# Altium project Modulo de apertura.PrjPcb
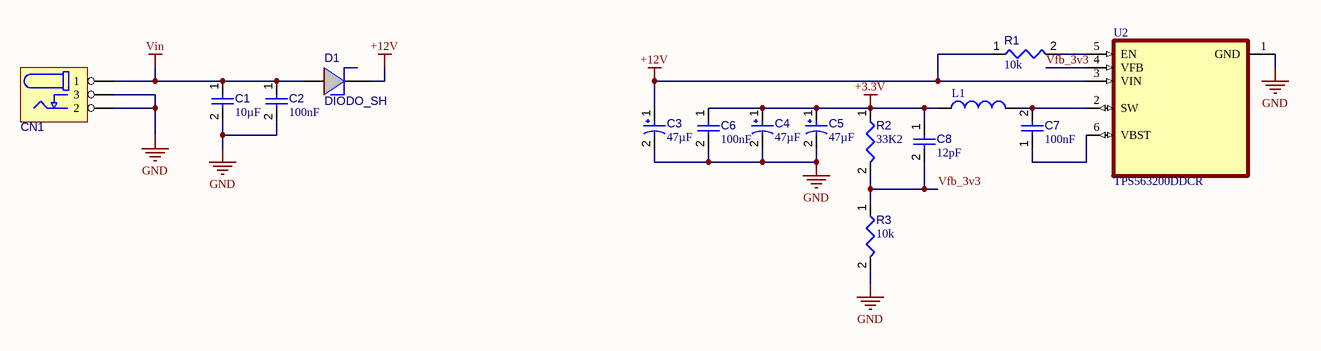
[diagram p0: Modulo_de_apertura_Power.SchDoc]
4 sheets, 75 parts. Net scope: global (net labels, ports and power ports of the same name join across sheets).
Board file: Modulo_de_apertura_PCB.PcbDoc
Sheets:
  Modulo_de_apertura_Power.SchDoc
  Modulo_de_apertura_RS485.SchDoc
  Modulo_de_apertura_perifericos.SchDoc
  Modulo_de_apertura_CPU.SchDoc

## Sheet Modulo_de_apertura_Power.SchDoc: Modulo de apertura Power
size A4; Author: Agustin Dubuisson; SheetNumber: 1; SheetTotal: 4

### Parts
C1  value 10µF  [CAPC0603(1608)100_L]  (hidden comment: Capacitor 10µF +/-20% 10V 0603)
C2  value 100nF  [CAPC0402(1005)60_L]  (hidden comment: Capacitor 100nF +/-20% 10V 0402)
C3  value 47µF  [CAPMP3217X18-T_V]  (hidden comment: TAJA105K035RNJ)
C4  value 47µF  [CAPMP3217X18-T_V]  (hidden comment: TAJA105K035RNJ)
C5  value 47µF  [CAPMP3217X18-T_V]  (hidden comment: TAJA105K035RNJ)
C6  value 100nF  [CAPC0402(1005)60_L]  (hidden comment: Capacitor 100nF +/-20% 50V 0402)
C7  value 100nF  [CAPC0402(1005)60_L]  (hidden comment: Capacitor 100nF +/-20% 10V 0402)
C8  value 12pF  [CAPC0402(1005)33_L]  (hidden comment: Capacitor 12pF +/-10% 50V 0402)
CN1  CN_PowerJack  [PJ002B]  (value not drawn)
D1  DIODO_SH  [D_SMA]
L1  IFSC1515AHER2R2M01  [FP-IFSC1515AH-MFG]  (value not drawn)
R1  value 10k  [RESC0402(1005)_L]  (hidden comment: Resistor 10K  +/-1 % 0402 63 mW)
R2  value 33K2  [RESC0402(1005)_L]  (hidden comment: Resistor 10K  +/-1 % 0402 63 mW)
R3  value 10k  [RESC0402(1005)_L]  (hidden comment: Resistor 10K  +/-1 % 0402 63 mW)
U2  TPS563200DDCR  [SOT23-6]

### Nets
+3.3V: C4.1 C5.1 C6.1 C8.1 L1.1 R2.1
+12V: C3.1 D1.2(K) R1.1 U2.3(VIN)
GND: C1.2 C2.2 C3.2 C4.2 C5.2 C6.2 CN1.2 CN1.3 R3.2 U2.1(GND)
Vin: C1.1 C2.1 CN1.1 D1.1(A)
Vfb_3v3: C8.2 R2.2 R3.1 U2.4(VFB)
NetC7_1: C7.1 U2.6(VBST)
NetC7_2: C7.2 L1.2 U2.2(SW)
NetR1_2: R1.2 U2.5(EN)

### Notes on the sheet
- Title:
- Size:
- Author:
- A4
- Sheet
- of
- Revision:
- File:
- Date:

### Library data of the parts
C1 = CMP-001-00075-4: Chip Capacitor, 10µF +/-20%, 10V, 0603, Thickness 1 mm; Tolerance: 10%; Voltage Rating: 10V; Max Operating Temperature: 85°C; Pins: 2; Case/Package: 0603; Mounting Technology: SMT; Min Operating Temperature: -55°C
C2 C7 = CMP-001-00061-3: Chip Capacitor, 100nF +/-20%, 10V, 0402, Thickness 0.6 mm; Tolerance: 20%; Mounting Technology: SMT; Voltage Rating: 10V; Max Operating Temperature: 85°C; Pins: 2; Case/Package: 0402; Min Operating Temperature: -55°C
C3-C5 = CMP-001-00040-7: Standard Tantalum, 1 uF, +/- 10%, 35 V, -55 to 125 degC, 1206 (3216 Metric), RoHS, Tape and Reel; Manufacturer: AVX; Voltage Rating: 35V; ESR: 7.5Ohm; Package Quantity: 2000; Case/Package: 1206; Datasheet Version: Feb-16; Tolerance: 10%; Max Operating Temperature: 125°C; Mounting Technology: SM; Package URL: http://www.avx.com/download/software/literature/AVX-Footprint-Library.pdf; Package Reference: CAPMP3217X18-T; Manufacturer URL: http://www.avx.com/; Min Operating Temperature: -55°C; Pins: 2; RoHS Compliant: True; Packaging: TapeandReel; Resistance: 7.5Ohm; Package Description: 2-Pin Surface Mount Device, Body 3.2 x 1.65 mm; Datasheet URL: http://datasheets.avx.com/TAJ.pdf; Capacitor Type: Tantalum
C6 = CMP-001-00067-3: Chip Capacitor, 100nF +/-20%, 50V, 0402, Thickness 0.6 mm; Tolerance: 10%; Min Operating Temperature: -55°C; Pins: 2; Case/Package: 0402; Max Operating Temperature: 85°C; Voltage Rating: 50V; Mounting Technology: SMT
C8 = CMP-001-00072-4: Chip Capacitor, 12pF +/-10%, 50V, 0402, Thickness 0.33 mm; Tolerance: 20%; Pins: 2; Max Operating Temperature: 85°C; Case/Package: 0402; Voltage Rating: 50V; Mounting Technology: SMT; Min Operating Temperature: -55°C
CN1 = CN_PowerJack: Barrel Power Connector
D1 = DIODO_SH: Diode Shottky
L1 = CMP-006-00026-1: General Purpose Inductor, 2.2uH, 20%, 1 Element, SMD, 1515; Max Current Rating: 3A; Max Operating Temperature: 125°C; Tolerance: 20%; RoHS Compliant: Yes; Pins: 2; Min Operating Temperature: -55°C
R1 R3 = CMP-009-00149-3: Chip Resistor, 10 kOhms, +/-1 %, 63 mW, -55 to 125 degC, 0402; Power: 63mW; Tolerance: 1%; Min Operating Temperature: -55°C; Case/Package: 0402; Max Operating Temperature: 155°C; Pins: 2
R2 = CMP-009-00149-3: Power: 63mW; Tolerance: 1%; Min Operating Temperature: -55°C; Case/Package: 0402; Max Operating Temperature: 155°C; Pins: 2
U2 = TPS563200DDCR: 17 V Input, 3A Synchronous Step-Down Regulator in SOT-23 with Advanced Eco-modeâ„¢; MF: Texas Instruments; SnapEDA_Link: https://www.snapeda.com/parts/TPS563200DDCR/Texas+Instruments/view-part/?ref=snap; Package: SOT-23-THN-6 Texas Instruments; Value: *; MP: TPS563200DDCR; Check_prices: https://www.snapeda.com/parts/TPS563200DDCR/Texas+Instruments/view-part/?ref=eda

## Sheet Modulo_de_apertura_RS485.SchDoc: Modulo de apertura RS485
size A4; Author: Agustin Dubuisson; SheetNumber: 2; SheetTotal: 4
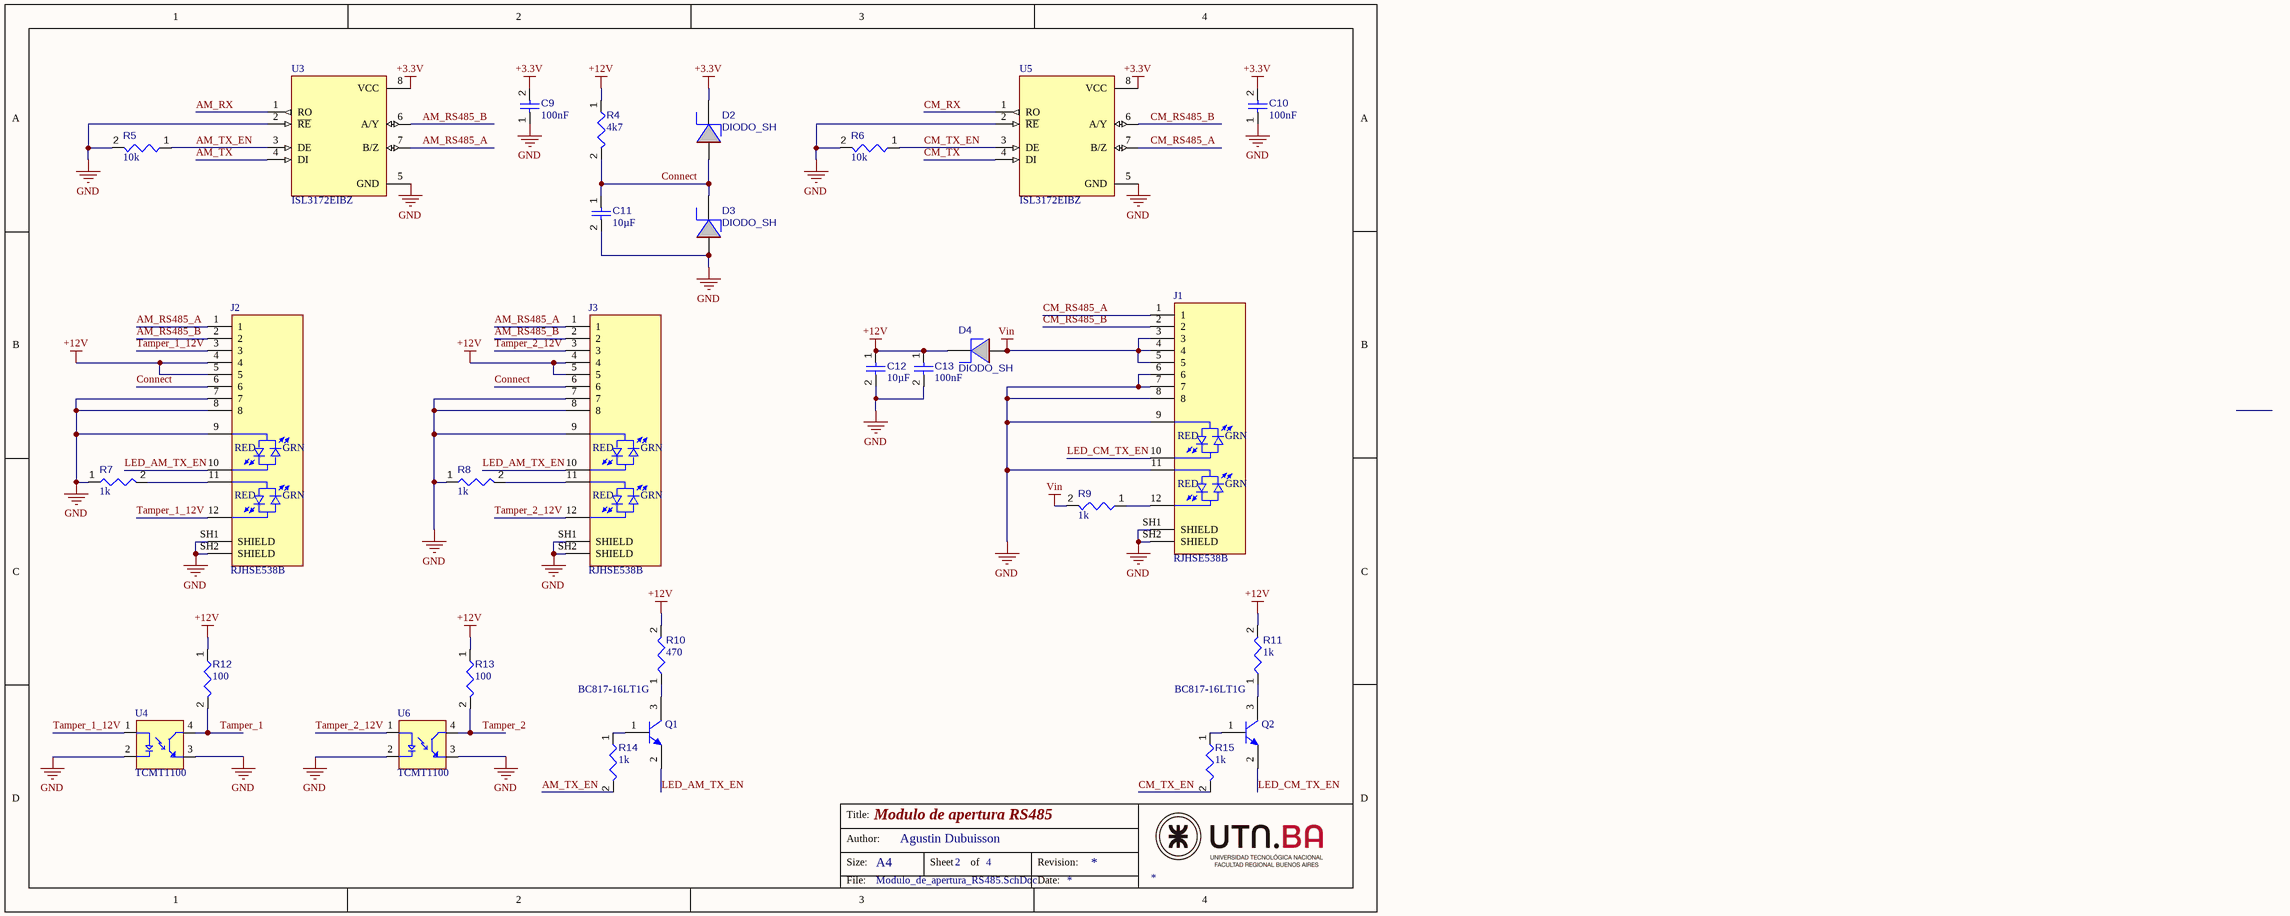
[diagram p1: Modulo_de_apertura_RS485.SchDoc]

### Parts
C9  value 100nF  [CAPC0402(1005)60_L]  (hidden comment: Capacitor 100nF +/-20% 10V 0402)
C10  value 100nF  [CAPC0402(1005)60_L]  (hidden comment: Capacitor 100nF +/-20% 10V 0402)
C11  value 10µF  [CAPC0603(1608)100_L]  (hidden comment: Capacitor 10µF +/-20% 10V 0603)
C12  value 10µF  [CAPC0603(1608)100_L]  (hidden comment: Capacitor 10µF +/-20% 10V 0603)
C13  value 100nF  [CAPC0402(1005)60_L]  (hidden comment: Capacitor 100nF +/-20% 10V 0402)
D2  DIODO_SH  [D_SMA]
D3  DIODO_SH  [D_SMA]
D4  DIODO_SH  [D_SMA]
J1  RJHSE538B  [AMPHENOL_RJHSE538B]
J2  RJHSE538B  [AMPHENOL_RJHSE538B]
J3  RJHSE538B  [AMPHENOL_RJHSE538B]
Q1  BC817-16LT1G  [ONSC-SOT-23-3-318-08_V]
Q2  BC817-16LT1G  [ONSC-SOT-23-3-318-08_V]
R4  value 4k7  [RESC0402(1005)_L]  (hidden comment: Resistor 10K  +/-1 % 0402 63 mW)
R5  value 10k  [RESC0402(1005)_L]  (hidden comment: Resistor 10K  +/-1 % 0402 63 mW)
R6  value 10k  [RESC0402(1005)_L]  (hidden comment: Resistor 10K  +/-1 % 0402 63 mW)
R7  value 1k  [RESC0402(1005)_L]  (hidden comment: Resistor 10K  +/-1 % 0402 63 mW)
R8  value 1k  [RESC0402(1005)_L]  (hidden comment: Resistor 10K  +/-1 % 0402 63 mW)
R9  value 1k  [RESC0402(1005)_L]  (hidden comment: Resistor 10K  +/-1 % 0402 63 mW)
R10  value 470  [RESC0402(1005)_L]  (hidden comment: Resistor 10K  +/-1 % 0402 63 mW)
R11  value 1k  [RESC0402(1005)_L]  (hidden comment: Resistor 10K  +/-1 % 0402 63 mW)
R12  value 100  [RESC0402(1005)_L]  (hidden comment: Resistor 10K  +/-1 % 0402 63 mW)
R13  value 100  [RESC0402(1005)_L]  (hidden comment: Resistor 10K  +/-1 % 0402 63 mW)
R14  value 1k  [RESC0402(1005)_L]  (hidden comment: Resistor 10K  +/-1 % 0402 63 mW)
R15  value 1k  [RESC0402(1005)_L]  (hidden comment: Resistor 10K  +/-1 % 0402 63 mW)
U3  ISL3172EIBZ  [SOIC127P600X175-8N]
U4  TCMT1100  [SOIC127P700X230-4N]
U5  ISL3172EIBZ  [SOIC127P600X175-8N]
U6  TCMT1100  [SOIC127P700X230-4N]

### Nets
+3.3V: C9.2 C10.2 D2.2(K) U3.8(VCC) U5.8(VCC)
+12V: C12.1 C13.1 D4.2(K) J2.4 J2.5 J3.4 J3.5 R4.1 R10.2 R11.2 R12.1 R13.1
GND: C9.1 C10.1 C11.2 C12.2 C13.2 D3.1(A) J1.6 J1.7 J1.8 J1.9 J1.11 J1.SH1(SHIELD) J1.SH2(SHIELD) J2.7 J2.8 J2.9 J2.SH1(SHIELD) J2.SH2(SHIELD) J3.7 J3.8 J3.9 J3.SH1(SHIELD) J3.SH2(SHIELD) R5.2 R6.2 R7.1 R8.1 U3.2(~{RE}) U3.5(GND) U4.2(C) U4.3(ET) U5.2(~{RE}) U5.5(GND) U6.2(C) U6.3(ET)
Vin: D4.1(A) J1.3 J1.4 J1.5 R9.2
AM_RS485_A: J2.1 J3.1 U3.7(B/Z)
AM_RS485_B: J2.2 J3.2 U3.6(A/Y)
AM_RX: U3.1(RO)
AM_TX: U3.4(DI)
AM_TX_EN: R5.1 R14.2 U3.3(DE)
CM_RS485_A: J1.1 U5.7(B/Z)
CM_RS485_B: J1.2 U5.6(A/Y)
CM_RX: U5.1(RO)
CM_TX: U5.4(DI)
CM_TX_EN: R6.1 R15.2 U5.3(DE)
Connect: C11.1 D2.1(A) D3.2(K) J2.6 J3.6 R4.2
LED_AM_TX_EN: J2.10 J3.10 Q1.2(E)
LED_CM_TX_EN: J1.10 Q2.2(E)
Tamper_1: R12.2 U4.4(CT)
Tamper_1_12V: J2.3 J2.12 U4.1(A)
Tamper_2: R13.2 U6.4(CT)
Tamper_2_12V: J3.3 J3.12 U6.1(A)
NetJ1_12: J1.12 R9.1
NetJ2_11: J2.11 R7.2
NetJ3_11: J3.11 R8.2
NetQ1_1: Q1.1(B) R14.1
NetQ1_3: Q1.3(C) R10.1
NetQ2_1: Q2.1(B) R15.1
NetQ2_3: Q2.3(C) R11.1

### Notes on the sheet
- Title:
- Size:
- Author:
- A4
- Sheet
- of
- Revision:
- File:
- Date:
- (in symbol RJHSE538B) RED; GRN

### Library data of the parts
C9 C10 C13 = CMP-001-00061-3: as C2 on sheet Modulo_de_apertura_Power; Mounting Technology: SMT; Voltage Rating: 10V; Max Operating Temperature: 85°C; Pins: 2; Case/Package: 0402; Min Operating Temperature: -55°C
C11 C12 = CMP-001-00075-4: as C1 on sheet Modulo_de_apertura_Power; Voltage Rating: 10V; Max Operating Temperature: 85°C; Pins: 2; Case/Package: 0603; Mounting Technology: SMT; Min Operating Temperature: -55°C
D2-D4 = DIODO_SH: Diode Shottky
J1-J3 = RJHSE538B: MF: {'manufacturer': u'Amphenol ICC (Commercial Products)'}; Package: None; Price: None; Value: *; MP: RJHSE538B; Availability: Unavailable
Q1 Q2 = CMP-1048-00736-1: General Purpose Transistor, NPN Silicon, 3-Pin SOT-23, Pb-Free, Tape and Reel; Manufacturer: On Semiconductor; IC Continuous (A): 0.5; fT Min (MHz): 100; PartNumber: BC817-16LT1G; Mounting Technology: Surface Mount; PackageVersion: Rev. AP, 11/2009; ComponentLink3Description: Package Specification; PackageReference: SOT-23-3-318-08; Packing: Tape and Reel; ComponentLink1URL: http://www.onsemi.com/; Polarity: NPN; RoHS: TRUE; ComponentLink2URL: http://www.onsemi.com/pub_link/Collateral/BC817-16LT1-D.PDF; ComponentLink3URL: http://www.onsemi.cn/pub_link/Collateral/318-08.PDF; ComponentLink2Description: Datasheet; PackageDescription: 3-Pin Small Outline Transistor, Body 2.92 x 1.3 mm, Pitch 0.95 mm; ComponentLink1Description: Manufacturer URL; DatasheetVersion: Rev. 12
R4-R15 = CMP-009-00149-3: as R1 on sheet Modulo_de_apertura_Power; Min Operating Temperature: -55°C; Case/Package: 0402; Max Operating Temperature: 155°C; Pins: 2
U3 U5 = ISL3172EIBZ: 1/1 Transceiver Half RS422, RS485 8-SOIC; MF: Renesas Electronics America Inc; SnapEDA_Link: https://www.snapeda.com/parts/ISL3172EIBZ/Renesas/view-part/?ref=snap; Package: SOIC-8 Renesas; Value: *; MP: ISL3172EIBZ; Check_prices: https://www.snapeda.com/parts/ISL3172EIBZ/Renesas/view-part/?ref=eda
U4 U6 = TCMT1100: Optoisolator Transistor Output 3750Vrms 1 Channel 4-SOP; MF: Vishay Semiconductor; SnapEDA_Link: https://www.snapeda.com/parts/TCMT1100/Vishay/view-part/?ref=snap; Package: SOP-4 Vishay Semiconductor; Value: *; MP: TCMT1100; Check_prices: https://www.snapeda.com/parts/TCMT1100/Vishay/view-part/?ref=eda

## Sheet Modulo_de_apertura_perifericos.SchDoc
size A4; SheetNumber: 3; SheetTotal: 4
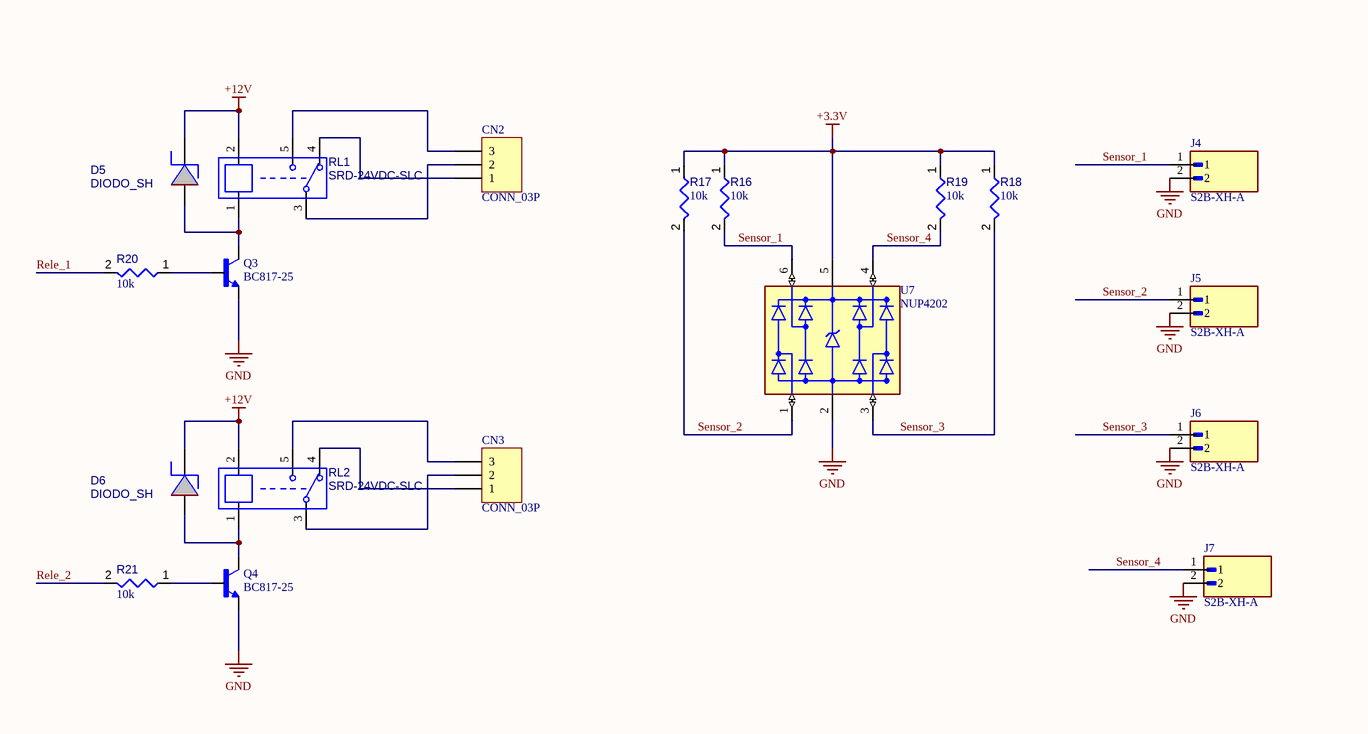
[diagram p2: Modulo_de_apertura_perifericos.SchDoc, left]
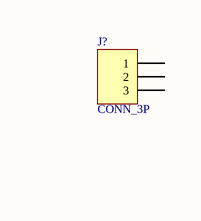
[diagram p3: Modulo_de_apertura_perifericos.SchDoc, right]

### Parts
CN2  CONN_03P  [TerminalBlock_1x3_P5mm]
CN3  CONN_03P  [TerminalBlock_1x3_P5mm]
D5  DIODO_SH  [D_SMA]
D6  DIODO_SH  [D_SMA]
J4  S2B-XH-A  [JST_S2B-XH-A]
J5  S2B-XH-A  [JST_S2B-XH-A]
J6  S2B-XH-A  [JST_S2B-XH-A]
J7  S2B-XH-A  [JST_S2B-XH-A]
J?  CONN_3P  [BORNERA_3P_P_5mm]
Q3  BC817-25  [SOT95P240X120-3N]
Q4  BC817-25  [SOT95P240X120-3N]
R16  value 10k  [RESC0402(1005)_L]  (hidden comment: Resistor 10K  +/-1 % 0402 63 mW)
R17  value 10k  [RESC0402(1005)_L]  (hidden comment: Resistor 10K  +/-1 % 0402 63 mW)
R18  value 10k  [RESC0402(1005)_L]  (hidden comment: Resistor 10K  +/-1 % 0402 63 mW)
R19  value 10k  [RESC0402(1005)_L]  (hidden comment: Resistor 10K  +/-1 % 0402 63 mW)
R20  value 10k  [RESC0402(1005)_L]  (hidden comment: Resistor 10K  +/-1 % 0402 63 mW)
R21  value 10k  [RESC0402(1005)_L]  (hidden comment: Resistor 10K  +/-1 % 0402 63 mW)
RL1  SRD-24VDC-SLC  [943-1C]
RL2  SRD-24VDC-SLC  [943-1C]
U7  NUP4202  [SOT65P210X100-6N]

### Nets
+3.3V: R16.1 R17.1 R18.1 R19.1 U7.5(VDD)
+12V: D5.2(K) D6.2(K) RL1.2 RL2.2
GND: J4.2 J5.2 J6.2 J7.2 Q3.2(E) Q4.2(E) U7.2(GND)
Rele_1: R20.2
Rele_2: R21.2
Sensor_1: J4.1 R16.2 U7.6(IO4)
Sensor_2: J5.1 R17.2 U7.1(IO1)
Sensor_3: J6.1 R18.2 U7.3(IO2)
Sensor_4: J7.1 R19.2 U7.4(IO3)
NetCN2_1: CN2.1 RL1.4
NetCN2_2: CN2.2 RL1.3
NetCN2_3: CN2.3 RL1.5
NetCN3_1: CN3.1 RL2.4
NetCN3_2: CN3.2 RL2.3
NetCN3_3: CN3.3 RL2.5
NetD5_1: D5.1(A) Q3.3(C) RL1.1
NetD6_1: D6.1(A) Q4.3(C) RL2.1
NetQ3_1: Q3.1(B) R20.1
NetQ4_1: Q4.1(B) R21.1

Not connected (* = marked no-connect by the designer): J? 1 2 3

### Library data of the parts
CN2 CN3 = CONN_03P: Connector Generic 3 Vias
D5 D6 = DIODO_SH: Diode Shottky
Q3 Q4 = BC817-25: BJT, SOT-23, 45V, 800mA, NPN, 0.31W, 150Â°C; MF: Diotec Semiconductor; SnapEDA_Link: https://www.snapeda.com/parts/BC817-25/Diotec/view-part/?ref=snap; Package: SOT-23 Diotec; Value: *; MP: BC817-25; Check_prices: https://www.snapeda.com/parts/BC817-25/Diotec/view-part/?ref=eda
R16-R21 = CMP-009-00149-3: as R1 on sheet Modulo_de_apertura_Power; Min Operating Temperature: -55°C; Case/Package: 0402; Max Operating Temperature: 155°C; Pins: 2
RL1 RL2 = RELAY SPDT
U7 = TESD5V0V4UCU6_RFG: SOT-363, 5V, 150W, 3pF, ESD Protection; MF: Taiwan Semiconductor; MP: TESD5V0V4UCU6 RFG; SnapEDA_Link: https://www.snapeda.com/parts/TESD5V0V4UCU6%20RFG/Taiwan+Semiconductor/view-part/?ref=snap; Package: SOT-363 Taiwan Semiconductor; Value: *; Check_prices: https://www.snapeda.com/parts/TESD5V0V4UCU6%20RFG/Taiwan+Semiconductor/view-part/?ref=eda
J4-J7 = S2B-XH-A: Package: None; Price: None; Value: *; MP: S2B-XH-A; Availability: Unavailable

## Sheet Modulo_de_apertura_CPU.SchDoc
size A4; SheetNumber: 4; SheetTotal: 4
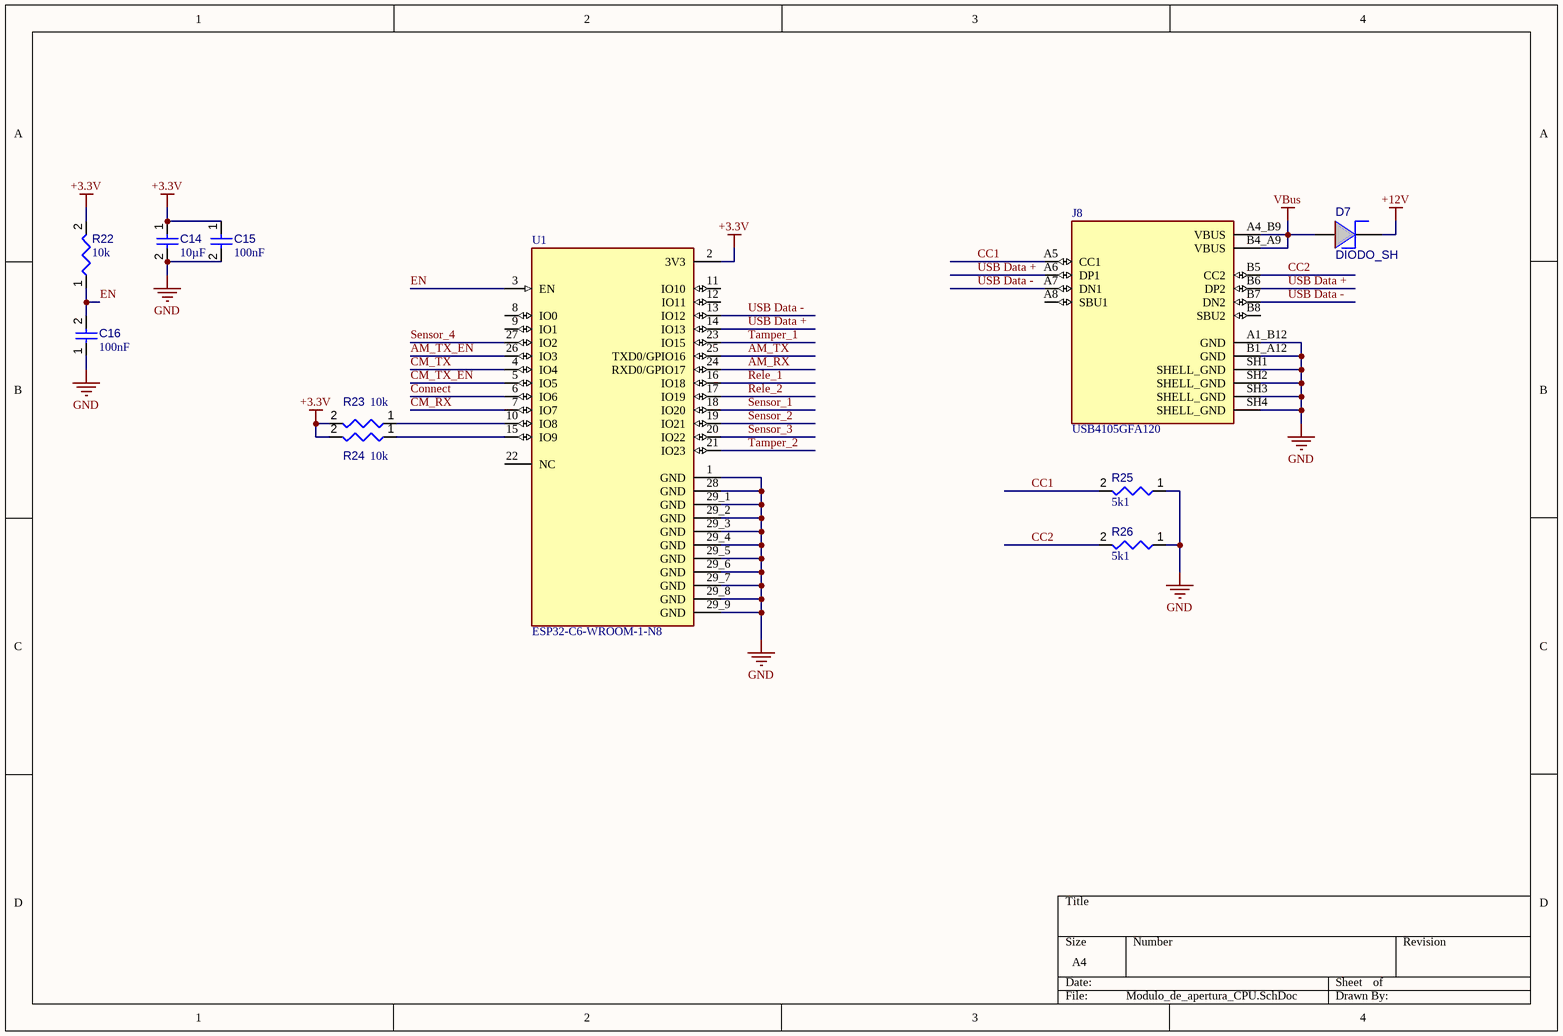
[diagram p4: Modulo_de_apertura_CPU.SchDoc]

### Parts
C14  value 10µF  [CAPC0603(1608)100_L]  (hidden comment: Capacitor 10µF +/-20% 10V 0603)
C15  value 100nF  [CAPC0402(1005)60_L]  (hidden comment: Capacitor 100nF +/-20% 10V 0402)
C16  value 100nF  [CAPC0402(1005)33_L]  (hidden comment: Capacitor 12pF +/-10% 50V 0402)
D7  DIODO_SH  [D_SMA]
J8  USB4105GFA120  [GCT_USB4105GFA120]
R22  value 10k  [RESC0402(1005)_L]  (hidden comment: Resistor 10K  +/-1 % 0402 63 mW)
R23  value 10k  [RESC0402(1005)_L]  (hidden comment: Resistor 10K  +/-1 % 0402 63 mW)
R24  value 10k  [RESC0402(1005)_L]  (hidden comment: Resistor 10K  +/-1 % 0402 63 mW)
R25  value 5k1  [RESC0402(1005)_L]  (hidden comment: Resistor 10K  +/-1 % 0402 63 mW)
R26  value 5k1  [RESC0402(1005)_L]  (hidden comment: Resistor 10K  +/-1 % 0402 63 mW)
U1  ESP32-C6-WROOM-1-N8  [XCVR_ESP32-C6-WROOM-1-N8]

### Nets
+3.3V: C14.1 C15.1 R22.2 R23.2 R24.2 U1.2(3V3)
+12V: D7.2(K)
GND: C14.2 C15.2 C16.1 J8.A1_B12(GND) J8.B1_A12(GND) J8.SH1(SHELL_GND) J8.SH2(SHELL_GND) J8.SH3(SHELL_GND) J8.SH4(SHELL_GND) R25.1 R26.1 U1.1(GND) U1.28(GND) U1.29_1(GND) U1.29_2(GND) U1.29_3(GND) U1.29_4(GND) U1.29_5(GND) U1.29_6(GND) U1.29_7(GND) U1.29_8(GND) U1.29_9(GND)
VBus: D7.1(A) J8.A4_B9(VBUS) J8.B4_A9(VBUS)
AM_RX: U1.24(RXD0/GPIO17)
AM_TX: U1.25(TXD0/GPIO16)
AM_TX_EN: U1.26(IO3)
CC1: J8.A5(CC1) R25.2
CC2: J8.B5(CC2) R26.2
CM_RX: U1.7(IO7)
CM_TX: U1.4(IO4)
CM_TX_EN: U1.5(IO5)
Connect: U1.6(IO6)
EN: C16.2 R22.1 U1.3(EN)
Rele_1: U1.16(IO18)
Rele_2: U1.17(IO19)
Sensor_1: U1.18(IO20)
Sensor_2: U1.19(IO21)
Sensor_3: U1.20(IO22)
Sensor_4: U1.27(IO2)
Tamper_1: U1.23(IO15)
Tamper_2: U1.21(IO23)
USB Data +: J8.A6(DP1) J8.B6(DP2) U1.14(IO13)
USB Data -: J8.A7(DN1) J8.B7(DN2) U1.13(IO12)
NetR23_1: R23.1 U1.10(IO8)
NetR24_1: R24.1 U1.15(IO9)

Not connected (* = marked no-connect by the designer): J8 A8(SBU1) B8(SBU2); U1 8(IO0) 9(IO1) 11(IO10) 12(IO11) 22(NC)

### Library data of the parts
C14 = CMP-001-00075-4: as C1 on sheet Modulo_de_apertura_Power; Voltage Rating: 10V; Max Operating Temperature: 85°C; Pins: 2; Case/Package: 0603; Mounting Technology: SMT; Min Operating Temperature: -55°C
C15 = CMP-001-00061-3: as C2 on sheet Modulo_de_apertura_Power; Mounting Technology: SMT; Voltage Rating: 10V; Max Operating Temperature: 85°C; Pins: 2; Case/Package: 0402; Min Operating Temperature: -55°C
C16 = CMP-001-00072-4: as C8 on sheet Modulo_de_apertura_Power; Pins: 2; Max Operating Temperature: 85°C; Case/Package: 0402; Voltage Rating: 50V; Mounting Technology: SMT; Min Operating Temperature: -55°C
D7 = DIODO_SH: Diode Shottky
J8 = USB4105GFA120: USB CONN, 2.0 TYPE C, RCPT, 16POS, SMT; USB Connector Type:USB Type C; USB Standard:USB 2.0; Gender:Receptacle; No. of Positions:16Positions; Connector Mounting:Surface Mount, Through Hole Mount; Orientation:Right Angle RoHS Compliant: Yes; MF: Global Connector Technology; SnapEDA_Link: https://www.snapeda.com/parts/USB4105GFA120/Global+Connector+Technology/view-part/?ref=snap; Package: None; Value: *; MP: USB4105GFA120; Check_prices: https://www.snapeda.com/parts/USB4105GFA120/Global+Connector+Technology/view-part/?ref=eda
R22-R26 = CMP-009-00149-3: as R1 on sheet Modulo_de_apertura_Power; Min Operating Temperature: -55°C; Case/Package: 0402; Max Operating Temperature: 155°C; Pins: 2
U1 = ESP32-C6-WROOM-1-N8: Multiprotocol Modules ESP32-C6 module, Wi-Fi 6 in 2.4 GHz band, Bluetooth 5, Zigbee 3.0 and Thread. ESP34-WROOM Compatible - ENGINEERING SAMPLE; MF: Espressif Systems; SnapEDA_Link: https://www.snapeda.com/parts/ESP32-C6-WROOM-1-N8/Espressif+Systems/view-part/?ref=snap; Package: SMD-28 Espressif Systems; Value: *; MP: ESP32-C6-WROOM-1-N8; Check_prices: https://www.snapeda.com/parts/ESP32-C6-WROOM-1-N8/Espressif+Systems/view-part/?ref=eda

## Nets that join several sheets
+3.3V: Modulo_de_apertura_Power (6 pins), Modulo_de_apertura_RS485 (5 pins), Modulo_de_apertura_perifericos (5 pins), Modulo_de_apertura_CPU (6 pins)
+12V: Modulo_de_apertura_Power (C3.1 D1.2 R1.1 U2.3), Modulo_de_apertura_RS485 (12 pins), Modulo_de_apertura_perifericos (D5.2 D6.2 RL1.2 RL2.2), Modulo_de_apertura_CPU (D7.2)
GND: Modulo_de_apertura_Power (10 pins), Modulo_de_apertura_RS485 (35 pins), Modulo_de_apertura_perifericos (7 pins), Modulo_de_apertura_CPU (22 pins)
Vin: Modulo_de_apertura_Power (C1.1 C2.1 CN1.1 D1.1), Modulo_de_apertura_RS485 (5 pins)
AM_RX: Modulo_de_apertura_RS485 (U3.1), Modulo_de_apertura_CPU (U1.24)
AM_TX: Modulo_de_apertura_RS485 (U3.4), Modulo_de_apertura_CPU (U1.25)
AM_TX_EN: Modulo_de_apertura_RS485 (R5.1 R14.2 U3.3), Modulo_de_apertura_CPU (U1.26)
CM_RX: Modulo_de_apertura_RS485 (U5.1), Modulo_de_apertura_CPU (U1.7)
CM_TX: Modulo_de_apertura_RS485 (U5.4), Modulo_de_apertura_CPU (U1.4)
CM_TX_EN: Modulo_de_apertura_RS485 (R6.1 R15.2 U5.3), Modulo_de_apertura_CPU (U1.5)
Connect: Modulo_de_apertura_RS485 (6 pins), Modulo_de_apertura_CPU (U1.6)
Rele_1: Modulo_de_apertura_perifericos (R20.2), Modulo_de_apertura_CPU (U1.16)
Rele_2: Modulo_de_apertura_perifericos (R21.2), Modulo_de_apertura_CPU (U1.17)
Sensor_1: Modulo_de_apertura_perifericos (J4.1 R16.2 U7.6), Modulo_de_apertura_CPU (U1.18)
Sensor_2: Modulo_de_apertura_perifericos (J5.1 R17.2 U7.1), Modulo_de_apertura_CPU (U1.19)
Sensor_3: Modulo_de_apertura_perifericos (J6.1 R18.2 U7.3), Modulo_de_apertura_CPU (U1.20)
Sensor_4: Modulo_de_apertura_perifericos (J7.1 R19.2 U7.4), Modulo_de_apertura_CPU (U1.27)
Tamper_1: Modulo_de_apertura_RS485 (R12.2 U4.4), Modulo_de_apertura_CPU (U1.23)
Tamper_2: Modulo_de_apertura_RS485 (R13.2 U6.4), Modulo_de_apertura_CPU (U1.21)